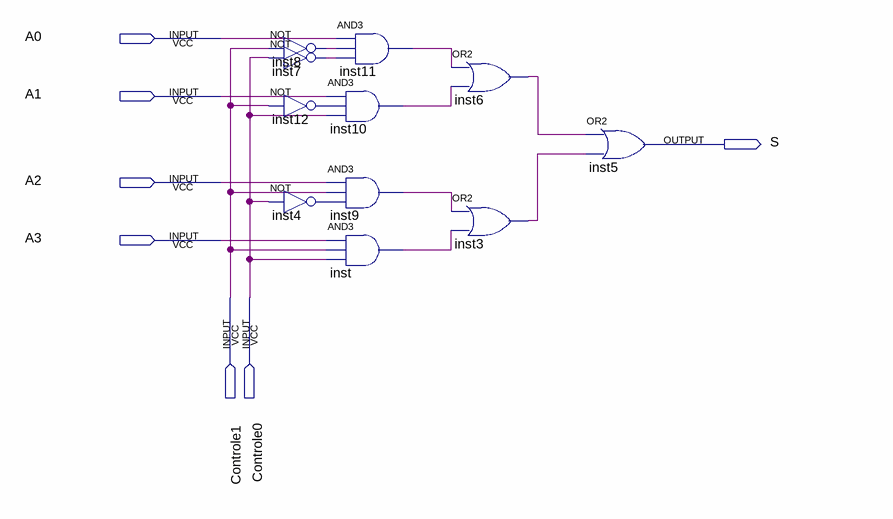
[diagram p0: schematic sheet]
// Quartus schematic Mux4X1.bdf as structural Verilog: 11 symbols, 7 pins
module Mux4X1 (
  input  A0,
  input  A1,
  input  A2,
  input  A3,
  input  Controle1,
  input  Controle0,
  output S
);

  wire inst3_out, inst4_out, inst6_out, inst7_out, inst8_out, inst9_out, inst10_out, inst11_out, inst12_out,
       inst_out;

  not inst8 (inst8_out, Controle1);
  not inst7 (inst7_out, Controle0);
  not inst12 (inst12_out, Controle1);
  not inst4 (inst4_out, Controle0);
  and inst11 (inst11_out, A0, inst8_out, inst7_out);
  and inst10 (inst10_out, A1, inst12_out, Controle0);
  and inst9 (inst9_out, A2, Controle1, inst4_out);
  and inst (inst_out, A3, Controle1, Controle0);
  or inst6 (inst6_out, inst11_out, inst10_out);
  or inst3 (inst3_out, inst9_out, inst_out);
  or inst5 (S, inst6_out, inst3_out);
endmodule
